# EAGLE design sensor_sheild_smirf (EAGLE 6.4)
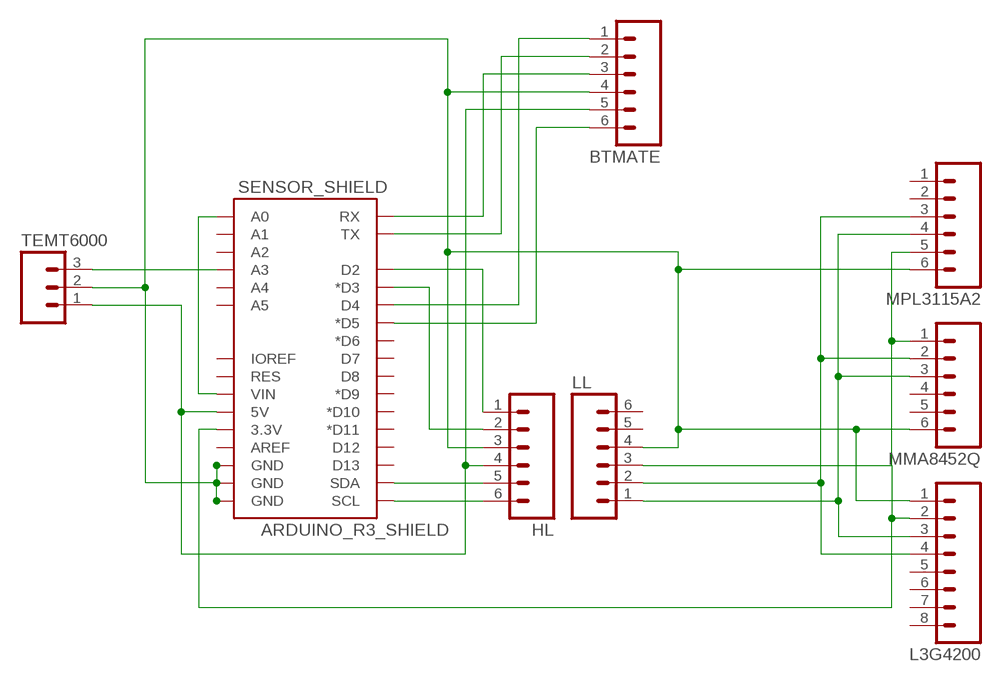
[diagram p0: schematic, sheet 1]

## Parts
BTMATE  M06NO_SILK  [1X06_NO_SILK]
HL  M06SIP  [1X06]
L3G4200  M08  [1X08_PIN1_NO_SILK]
LL  M06SIP  [1X06]
MMA8452Q  M06SIP  [1X06]
MPL3115A2  M06SIP  [1X06]
SENSOR_SHIELD  ARDUINO_R3_SHIELD  [UNO_R3_SHIELD]
TEMT6000  M031X03_NO_SILK  [1X03_NO_SILK]

## Nets
GND: BTMATE.4 HL.3 L3G4200.1 LL.4 MMA8452Q.6 MPL3115A2.6 SENSOR_SHIELD.GND@0(GND) SENSOR_SHIELD.GND@1(GND) SENSOR_SHIELD.GND@2(GND) TEMT6000.2
N$4: SENSOR_SHIELD.A0 SENSOR_SHIELD.VIN
N$7: BTMATE.2 SENSOR_SHIELD.TX
N$9: BTMATE.3 SENSOR_SHIELD.RX
N$10: BTMATE.1 SENSOR_SHIELD.D4
N$11: BTMATE.6 SENSOR_SHIELD.D5(*D5)
N$12: L3G4200.4 LL.2 MMA8452Q.2 MPL3115A2.3
N$13: HL.2 SENSOR_SHIELD.D3(*D3)
N$15: HL.1 SENSOR_SHIELD.D2
N$16: L3G4200.3 LL.1 MMA8452Q.3 MPL3115A2.4
N$20: HL.5 SENSOR_SHIELD.SDA
N$22: BTMATE.5 HL.4 SENSOR_SHIELD.5V TEMT6000.1
N$24: L3G4200.2 LL.3 MMA8452Q.1 MPL3115A2.5 SENSOR_SHIELD.3.3V
N$28: HL.6 SENSOR_SHIELD.SCL
N$33: SENSOR_SHIELD.A3 TEMT6000.3
Unconnected: L3G4200.5 L3G4200.6 L3G4200.7 L3G4200.8 LL.5 LL.6 MMA8452Q.4 MMA8452Q.5 MPL3115A2.1 MPL3115A2.2 SENSOR_SHIELD.A1 SENSOR_SHIELD.A2 SENSOR_SHIELD.A4 SENSOR_SHIELD.A5 SENSOR_SHIELD.AREF SENSOR_SHIELD.D6(*D6) SENSOR_SHIELD.D7 SENSOR_SHIELD.D8 SENSOR_SHIELD.D9(*D9) SENSOR_SHIELD.D10(*D10) SENSOR_SHIELD.D11(*D11) SENSOR_SHIELD.D12 SENSOR_SHIELD.D13 SENSOR_SHIELD.IOREF SENSOR_SHIELD.RES

## Library data of the parts
BTMATE HL LL MMA8452Q MPL3115A2 = SparkFun-Connectors:M06: Header 6 Standard 6-pin 0.1" header. Use with straight break away headers (SKU : PRT-00116), right angle break away headers (PRT-00553), swiss pins (PRT-00743), machine pins (PRT-00117), and female headers (PRT-00115). Molex polarized connector foot print use with SKU : PRT-08094 with associated crimp pins and housings. NOTES ON THE VARIANTS LOCK and LOCK_LONGPADS... This footprint was designed to help hold the alignment of a through-hole component (i.e. 6-pin header) while soldering it into place. You may notice that each hole has been shifted either up or down by 0.005 of an inch from it's more standard position (which is a perfectly straight line). This slight alteration caused the pins (the squares in the middle) to touch the edges of the holes. Because they are alternating, it causes a "brace" to hold the component in place. 0.005 has proven to be the perfect amount of "off-center" position when using our standard breakaway headers. Although looks a little odd when you look at the bare footprint, once you have a header in there, the alteration is very hard to notice. Also,if you push a header all the way into place, it is covered up entirely on the bottom side. This idea of altering the position of holes to aid alignment will be further integrated into the Sparkfun Library for other footprints. It can help hold any component with 3 or more connection pins.
L3G4200 = SparkFun-Connectors:M08: Header 8 Standard 8-pin 0.1" header. Use with straight break away headers (SKU : PRT-00116), right angle break away headers (PRT-00553), swiss pins (PRT-00743), machine pins (PRT-00117), and female headers (PRT-00115).
SENSOR_SHIELD = SparkFun-Boards:ARDUINO_R3_SHIELD: Shield form compatible with the Arduino Uno R3.
TEMT6000 = SparkFun-Connectors:M03: Header 3 Standard 3-pin 0.1" header. Use with straight break away headers (SKU : PRT-00116), right angle break away headers (PRT-00553), swiss pins (PRT-00743), machine pins (PRT-00117), and female headers (PRT-00115). Molex polarized connector foot print use with SKU : PRT-08232 with associated crimp pins and housings.

## Board
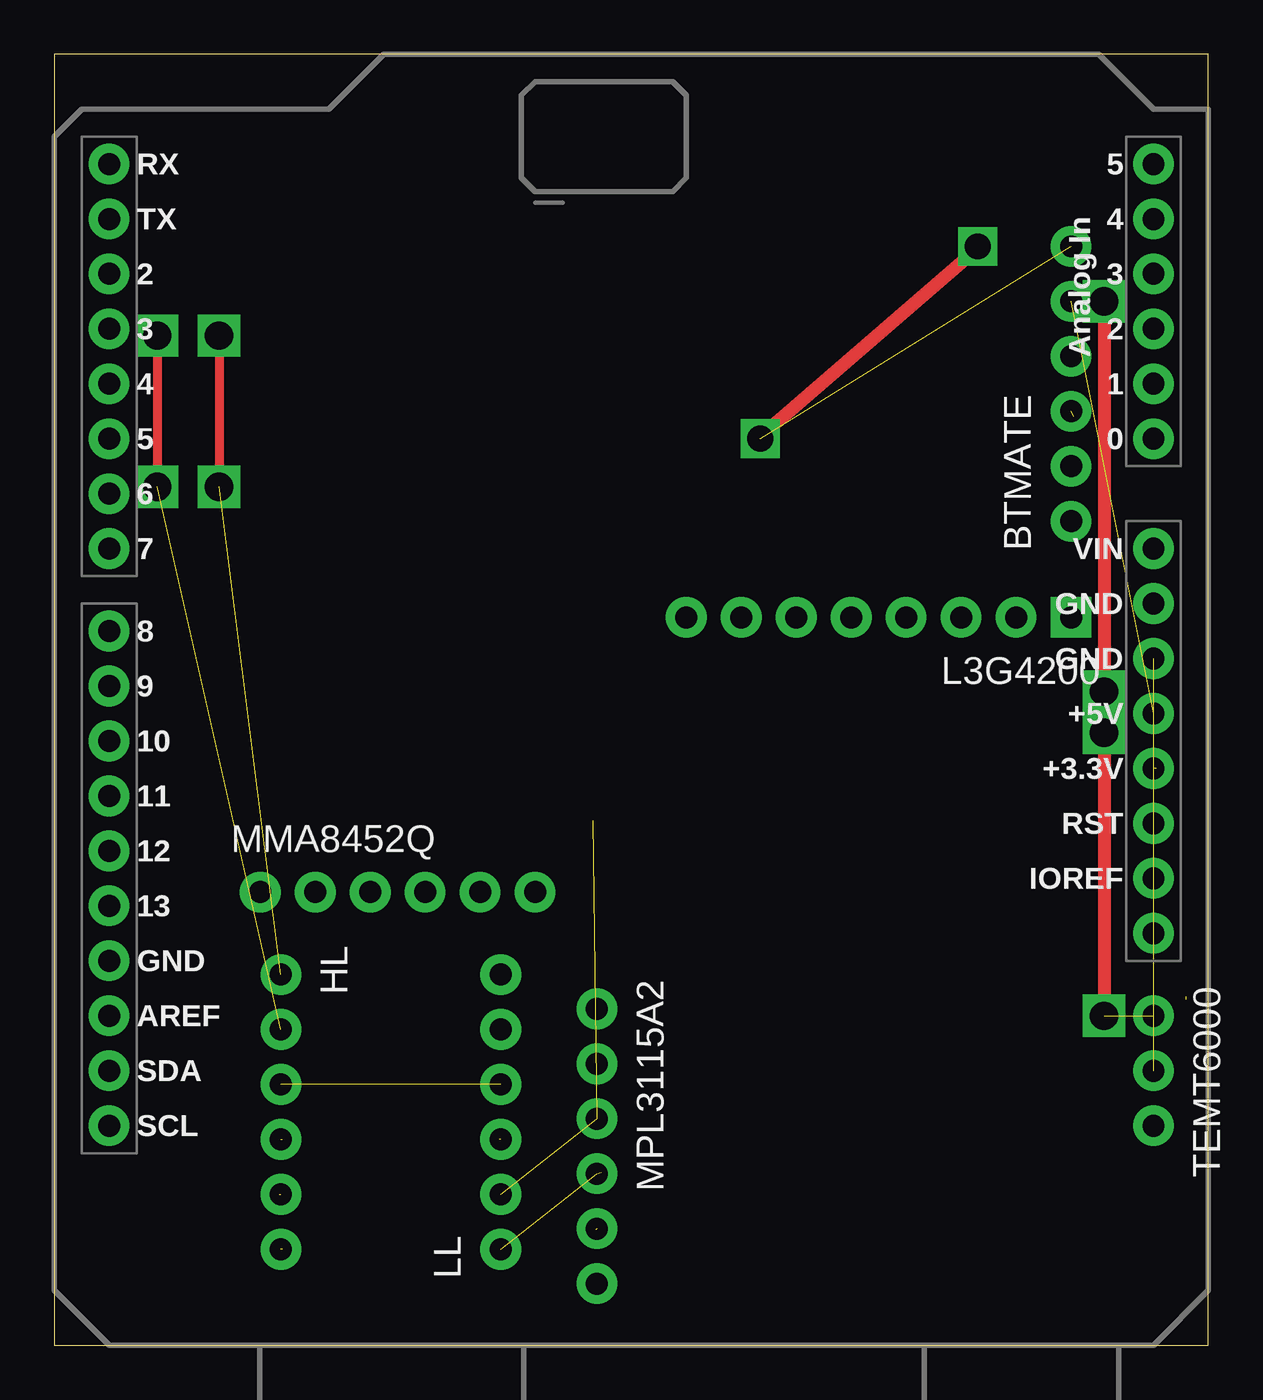
[diagram p1: board, top side]
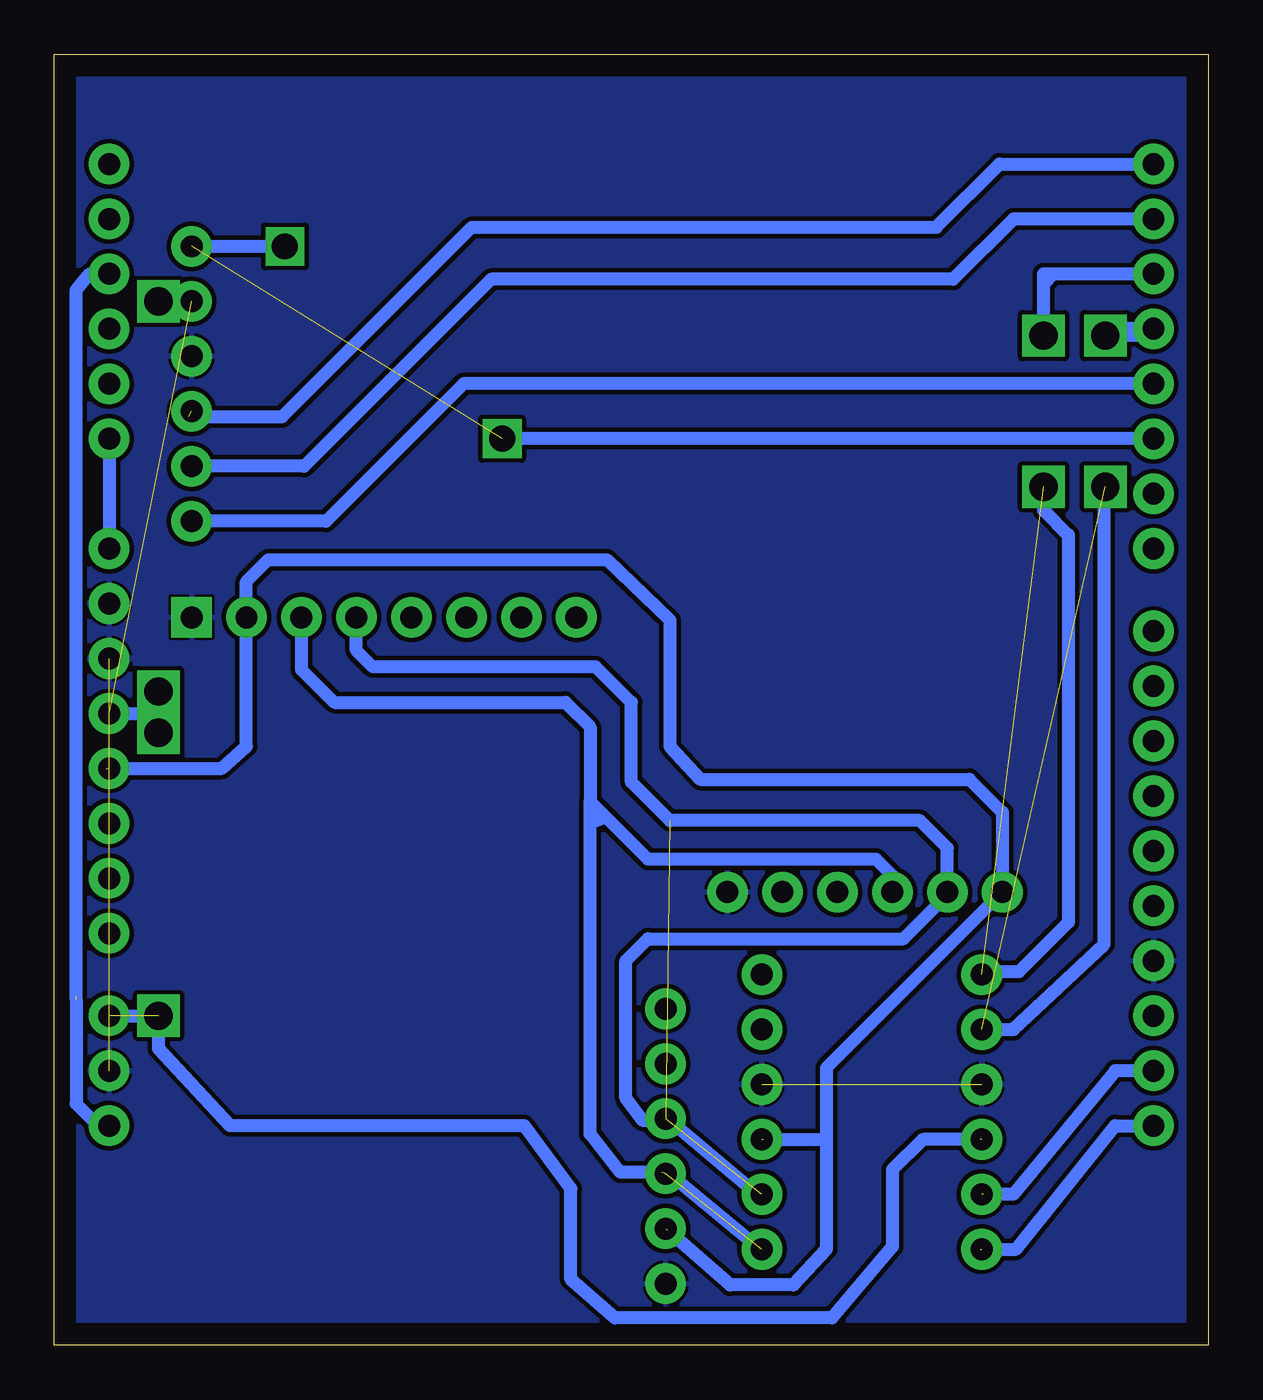
[diagram p2: board, bottom side, seen from below]

Size 53.34 x 59.69 mm. Coordinates in mm from the lower left corner, seen from the top.
Outline: 0,0 53.34,0 53.34,59.69 0,59.69 0,0
Copper layers (1*16): Top 0.035mm / dielectric 1.5mm / Bottom 0.035mm
Design rules "default *": minimum track width 10mil, minimum drill 24mil, track to track 8mil, track to pad 8mil, pad to pad 8mil, via to via 8mil, smd to smd 8mil, copper to edge 40mil, drill to drill 8mil, minimum pad ring 10mil, minimum via ring 8mil, stop-mask expansion 4mil, vias tented up to drill 0mil, thermal gap 5mil

### Footprints (pad centres in the part's own frame; a part is rotated, then mirrored left to right if it is on the bottom)
1X06_NO_SILK = drill 1.016 pad 1.88: 1 0,0; 2 2.54,0; 3 5.08,0; 4 7.62,0; 5 10.16,0; 6 12.7,0
1X06 = drill 1.016 pad 1.88: 1 0,0; 2 2.54,0; 3 5.08,0; 4 7.62,0; 5 10.16,0; 6 12.7,0
1X08_PIN1_NO_SILK = drill 1.016 pad 1.88 square: 1 0,0 | drill 1.016 pad 1.88: 2 2.54,0; 3 5.08,0; 4 7.62,0; 5 10.16,0; 6 12.7,0; 7 15.24,0; 8 17.78,0
UNO_R3_SHIELD = drill 1.016 pad 1.88: 3.3V 50.8,26.67; 5V 50.8,29.21; A0 50.8,41.91; A1 50.8,44.45; A2 50.8,46.99; A3 50.8,49.53; A4 50.8,52.07; A5 50.8,54.61; AREF 2.54,15.24; D2 2.54,49.53; D3 2.54,46.99; D4 2.54,44.45; D5 2.54,41.91; D6 2.54,39.37; D7 2.54,36.83; D8 2.54,33.02; D9 2.54,30.48; D10 2.54,27.94; D11 2.54,25.4; D12 2.54,22.86; D13 2.54,20.32; GND@0 50.8,31.75; GND@1 50.8,34.29; GND@2 2.54,17.78; IOREF 50.8,21.59; NC 50.8,19.05; RES 50.8,24.13; RX 2.54,54.61; SCL 2.54,10.16; SDA 2.54,12.7; TX 2.54,52.07; VIN 50.8,36.83
1X03_NO_SILK = drill 1.016 pad 1.88: 1 0,0; 2 2.54,0; 3 5.08,0

### Placement (x,y rotation side)
BTMATE  46.99,38.1 90 top
HL  10.48,17.14 270 top
L3G4200  46.99,33.66 180 top
LL  20.64,4.45 90 top
MMA8452Q  9.53,20.95 0 top
MPL3115A2  25.08,15.56 270 top
SENSOR_SHIELD  0,0 0 top
TEMT6000  50.8,15.24 270 top

### Tracks (layer width: path | path; a pad name or v marks a point on that pad's centre or on a via)
GND  (2 unrouted)
  pour Bottom: 0,59.69 53.34,59.69 53.34,0 0,0
N$2
  Bottom 0.61: 50.8,29.21 48.64,29.21
N$3
  Bottom 0.61: 7.62,39.5 7.62,38.61 6.48,37.47 6.48,19.56 8.76,17.27 10.41,17.27
N$4
  Bottom 0.61: SENSOR_SHIELD.A0 SENSOR_SHIELD.VIN
N$7
  Bottom 0.61: SENSOR_SHIELD.TX 9.02,52.07 11.81,49.28 33.15,49.28 41.78,40.64 BTMATE.2
N$8  (via drill 1.2)
  Bottom 0.61: 47.24,50.8 v42.67,50.8
N$9  (1 unrouted)
  Bottom 0.61: 47.12,42.93 42.8,42.93 34.04,51.69 12.57,51.69 9.65,54.61 SENSOR_SHIELD.RX
N$10
  Bottom 0.61: SENSOR_SHIELD.D4 34.42,44.45 40.77,38.1 BTMATE.1
N$11  (via drill 1.2)  (1 unrouted)
  Bottom 0.61: SENSOR_SHIELD.D5 v32.64,41.91
N$12  (2 unrouted)
  Bottom 0.61: MMA8452Q.2 12.06,22.99 13.34,24.26 24.89,24.26 26.67,26.04 26.67,29.72 28.32,31.37 38.61,31.37 39.37,32.13 L3G4200.4
N$13  (via drill 1.3)  (1 unrouted)
  Top 0.406: v4.76,46.67 v4.76,39.69
  Bottom 0.61: SENSOR_SHIELD.D3 4.76,46.99 v4.76,46.67 2.54,46.67
N$14
  Bottom 0.61: 10.54,14.61 9.02,14.61 4.83,18.54 4.83,39.75
N$15  (via drill 1.3)  (1 unrouted)
  Top 0.406: v7.62,46.67 v7.62,39.69
  Bottom 0.61: v7.62,46.67 7.62,49.05 | 7.62,49.05 7.62,49.53 7.14,49.53 | 7.14,49.53 SENSOR_SHIELD.D2 | 7.14,49.53 7.62,49.05
N$16  (2 unrouted)
  Bottom 0.61: 25.27,8 27.18,8 28.57,9.78 28.57,24.13 | L3G4200.3 41.91,31.24 40.39,29.72 29.72,29.72 28.57,28.57 28.57,25.15 | 28.57,25.15 25.91,22.48 15.37,22.48 14.61,21.72 MMA8452Q.3 | 28.57,24.13 28.57,25.15 | 27.94,24.38 28.57,24.13
N$18
  Bottom 0.61: 2.86,46.83 4.6,46.83
N$19
  Top 0.61: 32.51,41.91 42.8,50.8
N$20  (1 unrouted)
  Bottom 0.61: SENSOR_SHIELD.SDA 4.32,12.7 9.02,6.99 10.41,6.99
N$21  (via drill 1.3)
  other vias: 48.51,30.23
N$22  (via drill 1.3)  (4 unrouted)
  Bottom 0.61: 10.54,9.53 13.21,9.53 14.61,8.13 14.61,4.57 17.4,1.27 27.43,1.27 29.46,3.05 29.46,7.24 31.62,10.16 45.21,10.16 48.51,13.72 v48.51,15.24
N$23  (via drill 1.3)
  other vias: 48.51,28.32
N$24  (3 unrouted)
  Bottom 0.61: 50.93,26.67 45.59,26.67 44.45,27.69 L3G4200.2 44.45,35.31 43.43,36.32 27.81,36.32 24.89,33.53 24.89,27.69 23.5,26.16 11.05,26.16 9.53,24.64 MMA8452Q.1 17.65,12.83 17.65,9.53 | 25.02,5.33 22.1,2.79 19.18,2.79 17.65,4.45 17.65,9.4 17.65,9.53 | 20.57,9.53 17.65,9.53
N$25
  Bottom 0.61: 12.06,20.83 14.1,18.8 25.91,18.8 26.92,17.78 26.92,11.43 26.16,10.41 24.89,10.41 20.83,6.99 20.57,6.99
N$26
  Bottom 0.61: 20.7,4.45 25.02,8 25.15,8
N$27  (via drill 1.3)
  other vias: 48.51,48.26
N$28  (1 unrouted)
  Bottom 0.61: 10.54,4.45 8.89,4.45 4.32,10.16 SENSOR_SHIELD.SCL
N$29
  Top 0.61: 48.51,48.26 48.51,30.1
N$32
  Top 0.61: 48.51,28.32 48.51,15.11
N$33  (1 unrouted)
  Bottom 0.61: 52.32,16 52.32,11.18 51.31,10.16 TEMT6000.3 | 52.32,16.13 52.32,48.77 51.69,49.53 SENSOR_SHIELD.A3
N$34
  Bottom 0.61: 50.93,15.24 48.51,15.24